# EAGLE design LokomotivATMega328RevA (EAGLE 6.4)
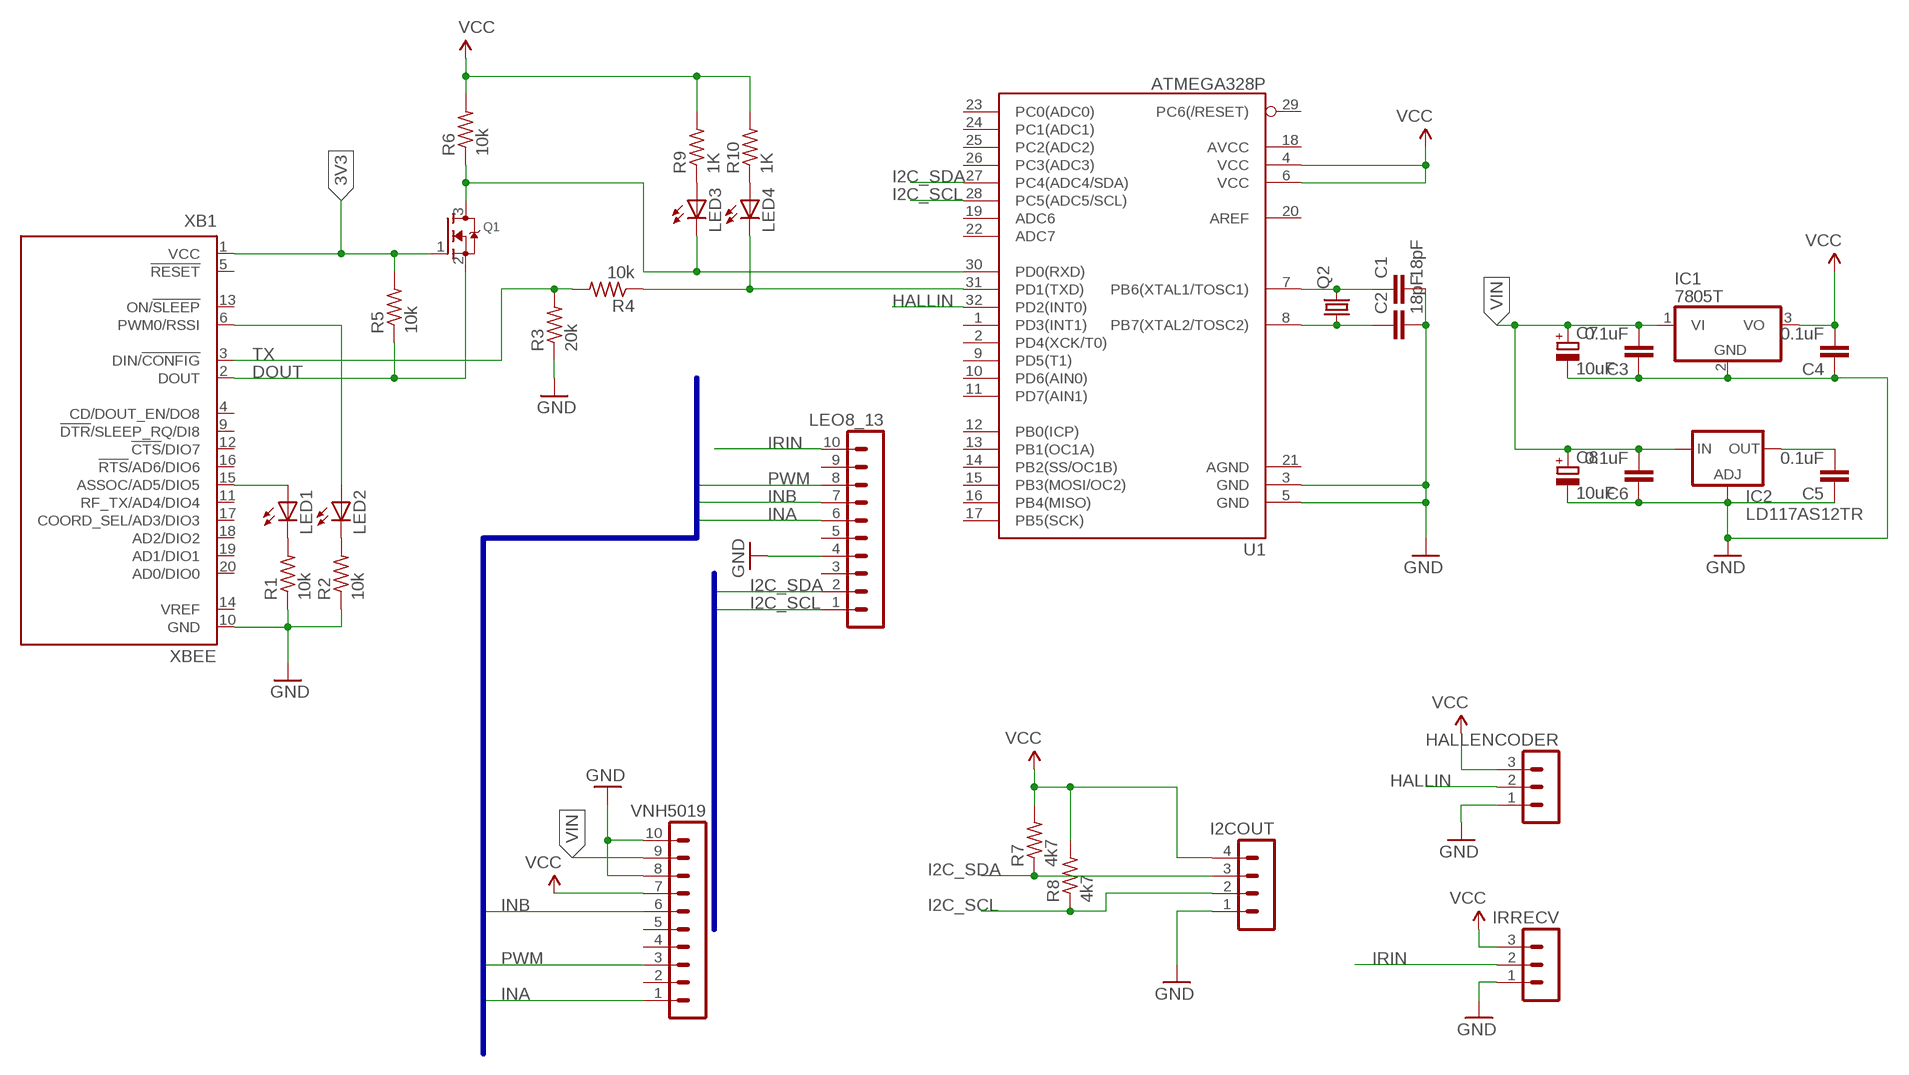
[diagram p0: schematic, sheet 1]

## Parts
C1  18pF  CAP0603-CAP  [0603-CAP]
C2  18pF  CAP0603-CAP  [0603-CAP]
C3  0.1uF  CAP0603-CAP  [0603-CAP]
C4  0.1uF  CAP0603-CAP  [0603-CAP]
C5  0.1uF  CAP0603-CAP  [0603-CAP]
C6  0.1uF  CAP0603-CAP  [0603-CAP]
C7  10uF  CPOL-EUE3.5-10  [E3,5-10]
C8  10uF  CPOL-EUE3.5-10  [E3,5-10]
HALLENCODER  MA03-1  [MA03-1]
I2COUT  MA04-1  [MA04-1]
IC1  7805T  [TO220H]
IC2  LD117AS12TR  [SOT223]
IRRECV  MA03-1  [MA03-1]
LED1  LED-FKIT-1206  [FKIT-LED-1206]
LED2  LED-FKIT-1206  [FKIT-LED-1206]
LED3  LED-FKIT-1206  [FKIT-LED-1206]
LED4  LED-FKIT-1206  [FKIT-LED-1206]
LEO8_13  MA10-1  [MA10-1]
Q1  MOSFET-NREFLOW  [SOT23]
Q2  CRYSTALSM49  [SM49]
R1  10k  R-US_R0805  [R0805]
R2  10k  R-US_R0805  [R0805]
R3  20k  R-US_R0805  [R0805]
R4  10k  R-US_R0805  [R0805]
R5  10k  R-US_R0805  [R0805]
R6  10k  R-US_R0805  [R0805]
R7  4k7  R-US_R0805  [R0805]
R8  4k7  R-US_R0805  [R0805]
R9  1K  R-US_R0805  [R0805]
R10  1K  R-US_R0805  [R0805]
U1  ATMEGA328P  ATMEGA328_SMT  [TQFP32-08]
VNH5019  MA10-1  [MA10-1]
XB1  XBEE  [XBEE]

## Nets
3V3: Q1.1(G) R5.2 XB1.1(VCC)
DOUT: Q1.2(S) R5.1 XB1.2(DOUT)
GND: C1.2 C2.2 C3.1 C4.1 C5.1 C6.1 C7.- C8.- HALLENCODER.1 I2COUT.1 IC1.2(GND) IC2.1(ADJ) IRRECV.1 LEO8_13.4 R1.1 R2.1 R3.1 U1.3(GND) U1.5(GND) VNH5019.8 VNH5019.10 XB1.10(GND)
HALLIN: HALLENCODER.2 U1.32(PD2(INT0))
I2C_SCL: I2COUT.2 LEO8_13.1 R8.1 U1.28(PC5(ADC5/SCL))
I2C_SDA: I2COUT.3 LEO8_13.2 R7.1 U1.27(PC4(ADC4/SDA))
INA: LEO8_13.6 VNH5019.1
INB: LEO8_13.7 VNH5019.6
IRIN: IRRECV.2 LEO8_13.10
N$1: LED1.C R1.2
N$2: LED2.C R2.2
N$3: LED1.A XB1.15(ASSOC/AD5/DIO5)
N$4: LED2.A XB1.6(PWM0/RSSI)
N$5: LED3.C Q1.3(D) R6.1 U1.30(PD0(RXD))
N$6: LED3.A R9.1
N$7: LED4.A R10.1
N$8: C1.1 Q2.2 U1.7(PB6(XTAL1/TOSC1))
N$9: LED4.C R4.1 U1.31(PD1(TXD))
N$10: C2.1 Q2.1 U1.8(PB7(XTAL2/TOSC2))
N$13: C5.2 IC2.4(OUT)
PWM: LEO8_13.8 VNH5019.3
TX: R3.2 R4.2 XB1.3(DIN/!CONFIG)
VCC: C4.2 HALLENCODER.3 I2COUT.4 IC1.3(VO) IRRECV.3 R6.2 R7.2 R8.2 R9.2 R10.2 U1.4(VCC) U1.6(VCC) VNH5019.7
VIN: C3.2 C6.2 C7.+ C8.+ IC1.1(VI) IC2.3(IN) VNH5019.9
Unconnected: LEO8_13.3 LEO8_13.5 LEO8_13.9 U1.1(PD3(INT1)) U1.2(PD4(XCK/T0)) U1.9(PD5(T1)) U1.10(PD6(AIN0)) U1.11(PD7(AIN1)) U1.12(PB0(ICP)) U1.13(PB1(OC1A)) U1.14(PB2(SS/OC1B)) U1.15(PB3(MOSI/OC2)) U1.16(PB4(MISO)) U1.17(PB5(SCK)) U1.18(AVCC) U1.19(ADC6) U1.20(AREF) U1.21(AGND) U1.22(ADC7) U1.23(PC0(ADC0)) U1.24(PC1(ADC1)) U1.25(PC2(ADC2)) U1.26(PC3(ADC3)) U1.29(PC6(/RESET)) VNH5019.2 VNH5019.4 VNH5019.5 XB1.4(CD/DOUT_EN/DO8) XB1.5(!RESET) XB1.9(!DTR!/SLEEP_RQ/DI8) XB1.11(RF_TX/AD4/DIO4) XB1.12(!CTS!/DIO7) XB1.13(ON/!SLEEP) XB1.14(VREF) XB1.16(!RTS!/AD6/DIO6) XB1.17(COORD_SEL/AD3/DIO3) XB1.18(AD2/DIO2) XB1.19(AD1/DIO1) XB1.20(AD0/DIO0)

## Buses
I2C_SDA,I2C_SCL
INA,INB,PWM,ENDIAG

## Library data of the parts
C1-C6 = SparkFun-Capacitors:CAP: Capacitor Standard 0603 ceramic capacitor, and 0.1" leaded capacitor.
C7 C8 = resistor:CPOL-EU: POLARIZED CAPACITOR, European symbol
HALLENCODER IRRECV = con-lstb:MA03-1: PIN HEADER; OC_FARNELL: unknown; OC_NEWARK: unknown
I2COUT = con-lstb:MA04-1: PIN HEADER; OC_FARNELL: unknown; OC_NEWARK: unknown
IC1 = adafruit:78*: Positive VOLTAGE REGULATOR Added bigger pads to the TO-92 package
IC2 = v-reg:LD117A?*: Low drop fixed and adjustable positive voltage regulators 1 A Source: http://www.st.com/stonline/products/literature/ds/7194/ld1117axx.pdf
LED1-LED4 = SparkFun-LED:LED: LEDs Standard schematic elements and footprints for 5mm, 3mm, 1206, and 0603 sized LEDs. 5mm - Spark Fun Electronics SKU : COM-00529 (and others)
LEO8_13 VNH5019 = con-lstb:MA10-1: PIN HEADER; OC_FARNELL: unknown; OC_NEWARK: unknown
Q1 = adafruit:MOSFET-N: N-Channel Mosfet 2N7002E - 60V 260mA SOT23 [Digikey: 2N7002ET1GOSTR-ND] - REEL BSH103 - 30V 850mA SOT23 [Digikey: 568-5013-1-ND]
Q2 = adafruit:CRYSTAL: CRYSTAL; OC_FARNELL: unknown; OC_NEWARK: unknown
R1-R10 = adafruit:R-US_: RESISTOR, American symbol
U1 = SparkFun-DigitalIC:ATMEGA328_SMT: 32-Pin Atmega328 part Commonly used on Arduino compatible boards Available in QFP and QFN packages TQFP is IC-09069 QFN is non-stock; PROD_ID: IC-09069
XB1 = maxstream:XBEE: XBee (TM) /XBee-PRO(TM) OEM RF Modules Source: MaxStream, Inc. xbee_productmanual.pdf; MPN: XBP24-Z7UIT-004; OC_FARNELL: 1751799; OC_NEWARK: 34R5507

## Net classes
0 Default: width 0.406 mm, drill 0.381 mm, clearance 1.016 mm

## Board
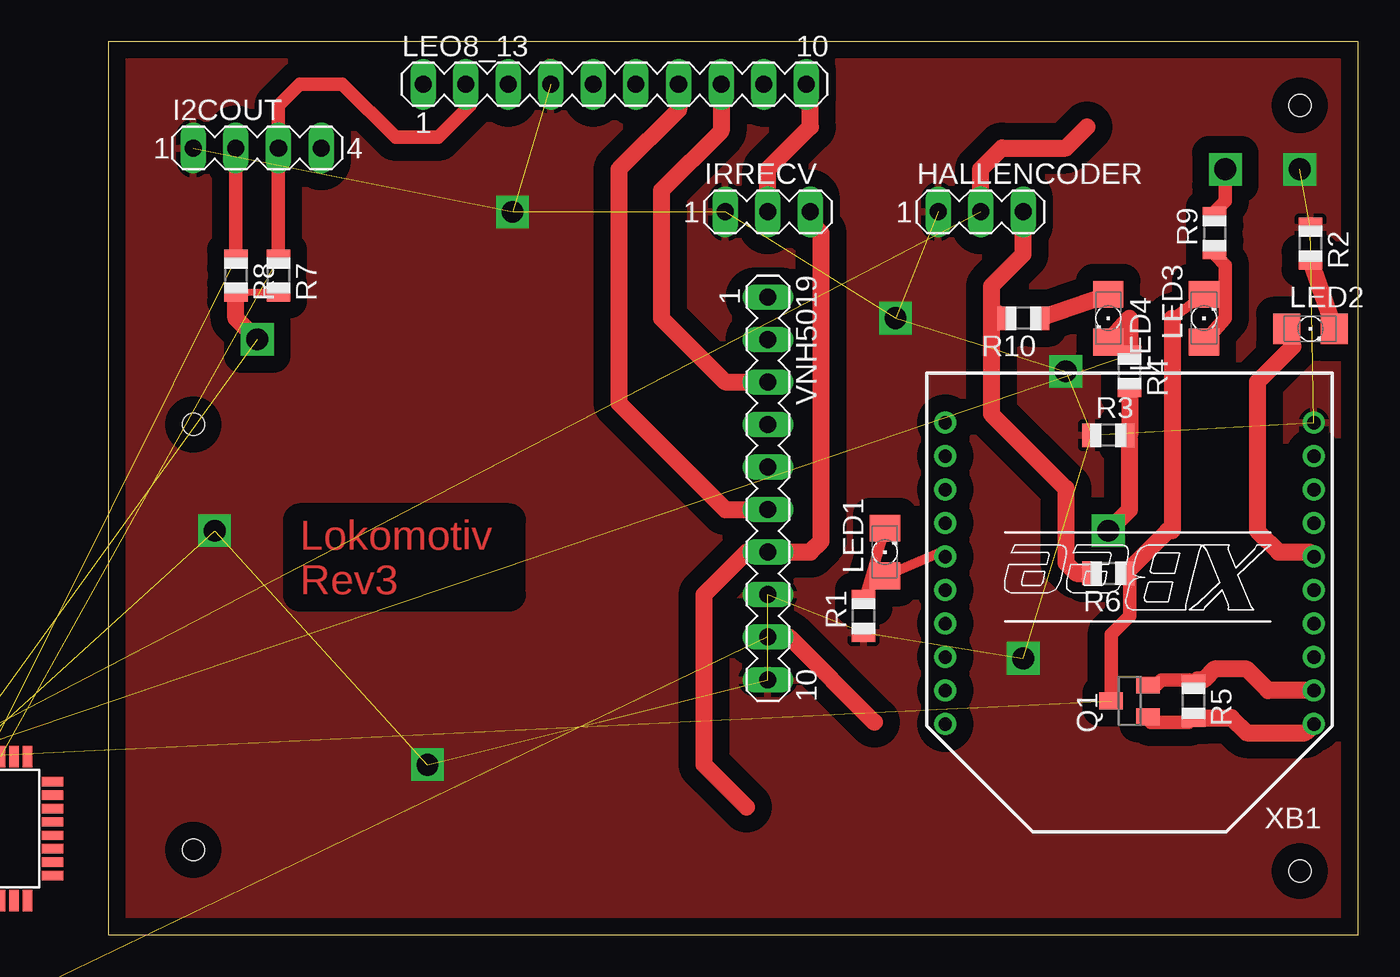
[diagram p1: board, top side]
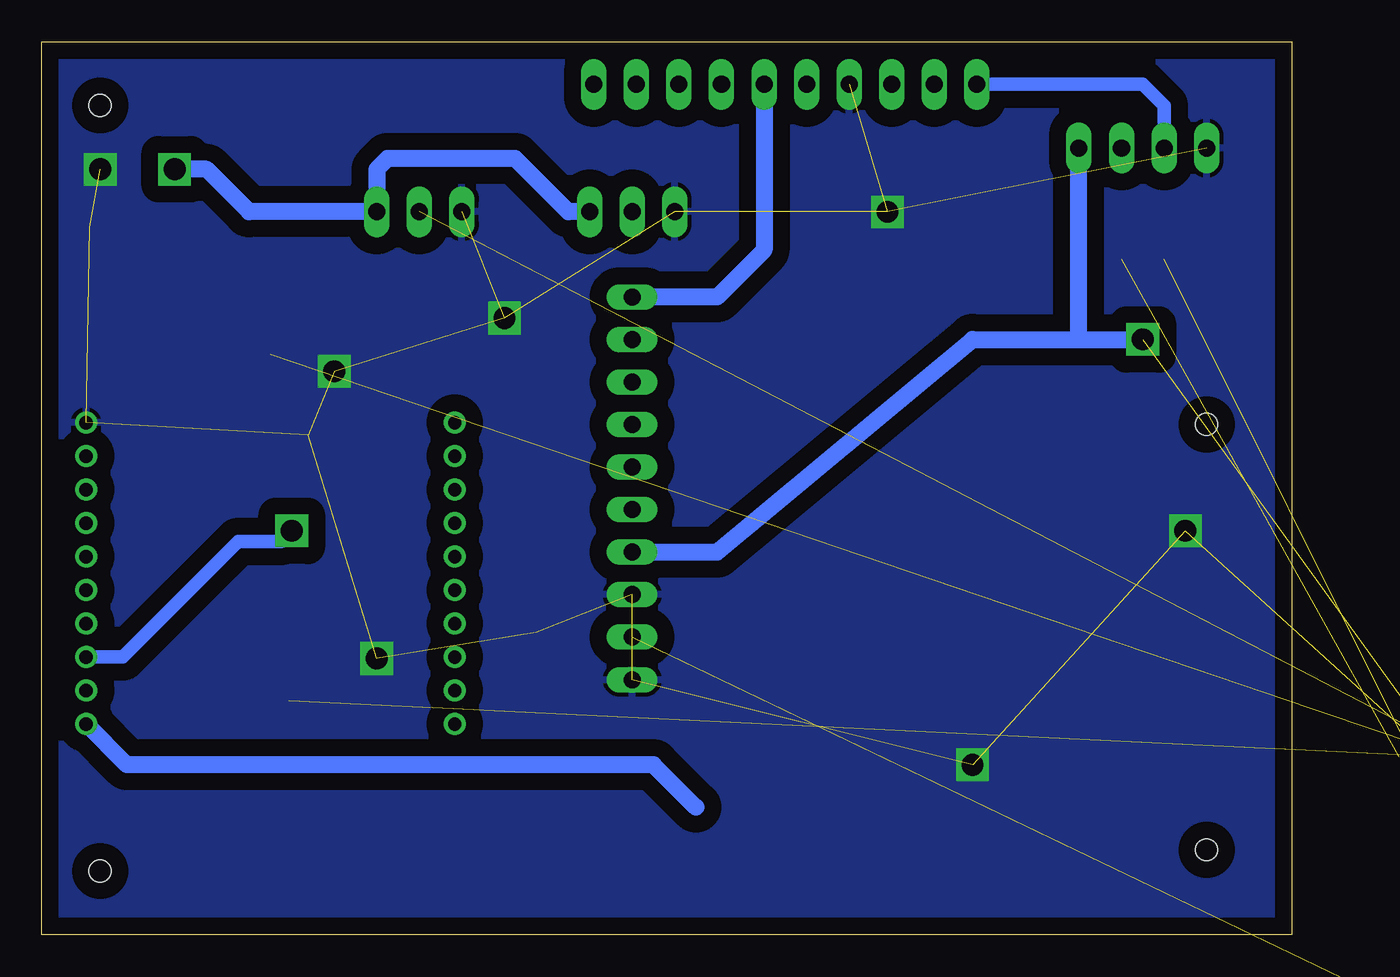
[diagram p2: board, bottom side, seen from below]

Size 74.6 x 53.33 mm. Coordinates in mm from the lower left corner, seen from the top.
Outline: 0,0 74.6,0 74.6,53.33 0,53.33 0,0
Copper layers (1*16): Top 0.035mm / dielectric 1.5mm / Bottom 0.035mm
Design rules "default": minimum track width 10mil, minimum drill 24mil, track to track 8mil, track to pad 8mil, pad to pad 8mil, via to via 8mil, smd to smd 8mil, copper to edge 40mil, drill to drill 8mil, minimum pad ring 10mil, minimum via ring 8mil, stop-mask expansion 4mil, vias tented up to drill 0mil, thermal gap 10mil
Holes 1.3 mm at 5.08,5.08 5.08,30.48 71.12,49.53 71.12,3.81

### Footprints (pad centres in the part's own frame; a part is rotated, then mirrored left to right if it is on the bottom)
0603-CAP = smd 1.1 x 1: 1 -0.85,0; 2 0.85,0
E3,5-10 = drill 0.813 pad 1.6: + -1.778,0 | drill 0.813 pad 1.6 octagon: - 1.778,0
MA03-1 = drill 1.016 long: 1 -2.54,0; 2 0,0; 3 2.54,0
MA04-1 = drill 1.016 long: 1 -3.81,0; 2 -1.27,0; 3 1.27,0; 4 3.81,0
TO220H = drill 1.118 long: 1 -2.54,-10.16; 2 0,-10.16; 3 2.54,-10.16 | hole 3.302: 0,4.826
SOT223 = smd 1.5 x 2: 1 -2.3,-3.15; 2 0,-3.15; 3 2.3,-3.15 | smd 3.8 x 2: 4 0,3.15
FKIT-LED-1206 = smd 1.6 x 1.803: A -1.422,0; C 1.422,0
MA10-1 = drill 1.016 long: 1 -11.43,0; 2 -8.89,0; 3 -6.35,0; 4 -3.81,0; 5 -1.27,0; 6 1.27,0; 7 3.81,0; 8 6.35,0; 9 8.89,0; 10 11.43,0
SOT23 = smd 1 x 1.4: 1 -0.95,-1.1; 2 0.95,-1.1; 3 0,1.1
SM49 = smd 5.08 x 1.778: 1 -4.826,0; 2 4.826,0
R0805 = smd 1.1 x 1.4: 1 -1,0; 2 1,0
TQFP32-08 = smd 1.27 x 0.559: 1 -4.293,2.8; 2 -4.293,2; 3 -4.293,1.2; 4 -4.293,0.4; 5 -4.293,-0.4; 6 -4.293,-1.2; 7 -4.293,-2; 8 -4.293,-2.8; 17 4.293,-2.8; 18 4.293,-2; 19 4.293,-1.2; 20 4.293,-0.4; 21 4.293,0.4; 22 4.293,1.2; 23 4.293,2; 24 4.293,2.8 | smd 0.559 x 1.27: 9 -2.8,-4.293; 10 -2,-4.293; 11 -1.2,-4.293; 12 -0.4,-4.293; 13 0.4,-4.293; 14 1.2,-4.293; 15 2,-4.293; 16 2.8,-4.293; 25 2.8,4.293; 26 2,4.293; 27 1.2,4.293; 28 0.4,4.293; 29 -0.4,4.293; 30 -1.2,4.293; 31 -2,4.293; 32 -2.8,4.293
XBEE = drill 0.8 pad 1.27: 1 -11,9; 2 -11,7; 3 -11,5; 4 -11,3; 5 -11,1; 6 -11,-1; 7 -11,-3; 8 -11,-5; 9 -11,-7; 10 -11,-9; 11 11,-9; 12 11,-7; 13 11,-5; 14 11,-3; 15 11,-1; 16 11,1; 17 11,3; 18 11,5; 19 11,7; 20 11,9

### Placement (x,y rotation side)
C1  -10.16,-11.43 0 top  (outside the outline)
C2  -10.16,-13.97 0 top  (outside the outline)
C3  -35.56,-17.78 0 top  (outside the outline)
C4  -35.56,-21.59 0 top  (outside the outline)
C5  -35.56,-25.4 0 top  (outside the outline)
C6  -35.56,-29.21 0 top  (outside the outline)
C7  -31.75,-36.83 0 top  (outside the outline)
C8  -31.75,-48.26 0 top  (outside the outline)
HALLENCODER  52.07,43.18 0 top
I2COUT  8.89,46.99 0 top
IC1  -21.59,-2.54 0 top  (outside the outline)
IC2  -34.29,-10.16 0 top  (outside the outline)
IRRECV  39.37,43.18 0 top
LED1  46.35,22.86 90 top
LED2  71.75,36.2 0 top
LED3  65.41,36.83 90 top
LED4  59.69,36.83 270 top
LEO8_13  30.23,50.8 0 top
Q1  60.96,13.97 90 top
Q2  -5.08,-6.35 0 top  (outside the outline)
R1  45.09,19.05 90 top
R2  71.75,41.27 270 top
R3  59.69,29.84 0 top
R4  60.96,33.66 270 top
R5  64.77,13.97 270 top
R6  59.69,21.59 180 top
R7  10.16,39.37 270 top
R8  7.62,39.37 270 top
R9  66.04,41.91 90 top
R10  54.61,36.83 180 top
U1  -7.62,6.35 0 top  (outside the outline)
VNH5019  39.37,26.67 270 top
XB1  60.96,21.59 180 top

### Tracks (layer width: path | path; a pad name or v marks a point on that pad's centre or on a via)
3V3
  Top 0.406: 64.72,13.02 R5.2
  Top 0.813: Q1.1 62.06,12.87 62.23,12.7 64.5,12.7 R5.2
  Top 1.016: R5.2 67.04,12.97 67.94,12.06 71.44,12.06 XB1.1
  Bottom 1.016: 35.56,7.62 38.1,10.16 69.53,10.16 XB1.1
DOUT
  Top 0.406: 64.72,14.92 R5.1
  Top 0.813: Q1.2 62.55,14.92 62.87,15.24 64.5,15.24 R5.1
  Top 1.016: XB1.2 69.23,14.59 67.94,15.88 66.04,15.88 65.41,15.24 65.04,15.24 R5.1
GND  (via drill 1.3)  (28 unrouted)
  other vias: 57.15,33.66 6.35,24.13 19.05,10.16 24.13,43.18 54.61,16.51 46.99,36.83 71.12,45.72
  pour Bottom: -1.27,53.34 -1.27,0 76.2,0 76.2,54.61 -1.27,54.61
  pour Top: 0,53.34 74.93,53.34 74.93,50.8 74.93,0 0,0
HALLIN  (1 unrouted)
  Top 1.016: HALLENCODER.2 52.07,45.72 53.34,46.99 57.15,46.99 58.42,48.26
I2C_SCL  (1 unrouted)
  Top 0.813: R8.1 I2COUT.2
  Bottom 0.813: LEO8_13.1 8.89,50.8 7.62,49.53 I2COUT.2
I2C_SDA  (1 unrouted)
  Top 0.813: R7.1 I2COUT.3 10.16,49.53 11.43,50.8 13.97,50.8 17.14,47.62 19.68,47.62 21.59,49.53 21.59,50.55 LEO8_13.2
INA
  Bottom 1.016: LEO8_13.6 31.5,40.89 34.29,38.1 VNH5019.1
INB
  Top 1.016: LEO8_13.7 34.04,49.28 30.48,45.72 30.48,31.75 36.83,25.4 VNH5019.6
IRIN
  Top 1.016: IRRECV.2 39.37,45.72 41.91,48.26 41.91,50.55 LEO8_13.10
N$1
  Top 0.61: LED1.C R1.2
N$2
  Top 1.016: R2.2 LED2.C
N$3
  Top 0.61: LED1.A 49.69,22.86 XB1.15
N$4
  Top 1.016: LED2.A 70.7,35.15 68.58,33.02 68.58,24.13 69.85,22.86 71.69,22.86 XB1.6
N$5  (1 unrouted)
  Top 0.61: LED3.C 63.5,36.83
  Top 0.813: Q1.3 59.86,17.95 60.96,19.05 60.96,21.32 R6.1
  Top 1.016: 63.5,36.83 63.5,24.13 63.23,24.13 R6.1
N$6
  Top 0.813: R9.1 66.04,40.64 66.67,40.01 66.67,36.83 LED3.A
N$7
  Top 1.016: R10.1 LED4.A
N$8  (2 unrouted)
N$9  (1 unrouted)
  Top 1.016: LED4.C 60.96,36.83 R4.1
N$10  (2 unrouted)
N$13  (1 unrouted)
PWM
  Top 1.016: LEO8_13.8 36.58,48.01 33.02,44.45 33.02,36.83 36.83,33.02 VNH5019.3
TX  (via drill 1.3)
  Top 1.016: R4.2 60.96,29.84 R3.2 60.96,29.57 60.96,25.4 v59.69,24.13
  Bottom 0.813: XB1.3 69.77,16.59 62.87,23.5 60.33,23.5 v59.69,24.13
VCC  (via drill 1.3)  (4 unrouted)
  Top 0.406: R7.2 R8.2
  Top 0.813: R9.2 66.04,43.18 66.67,43.81 v66.67,45.72
  Top 1.016: R6.2 57.78,21.59 57.15,22.23 57.15,26.67 52.7,31.11 52.7,37.47 | v8.89,35.56 7.62,36.83 R8.2 | 52.7,37.47 52.7,38.73 54.61,40.64 HALLENCODER.3 | 52.7,37.47 53.34,36.83 R10.2 | 38.1,7.62 35.56,10.16 35.56,20.32 38.1,22.86 VNH5019.7 41.91,22.86 42.55,23.5 42.55,41.91 41.91,42.55 IRRECV.3
  Bottom 1.016: 12.7,35.56 I2COUT.4 | IRRECV.3 43.18,43.18 46.35,46.35 53.98,46.35 54.61,45.72 HALLENCODER.3 62.23,43.18 64.77,45.72 v66.67,45.72 | 12.7,35.56 v8.89,35.56 | VNH5019.7 34.29,22.86 19.05,35.56 12.7,35.56
VIN  (6 unrouted)
  Top 1.016: VNH5019.9 40.64,17.78 45.72,12.7

### Text on the board
Top: Lokomotiv / Rev3